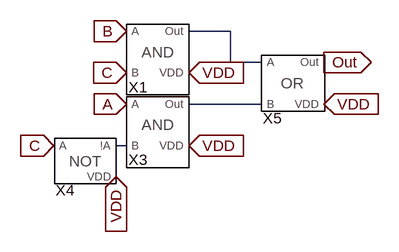
[diagram p0: schematic MUX.asc]
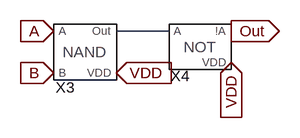
[diagram p1: sub-circuit gate_and.asc]
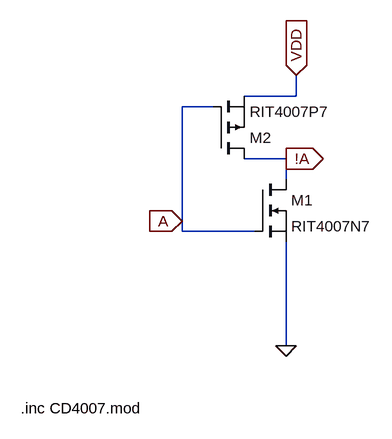
[diagram p2: sub-circuit gate_not.asc]
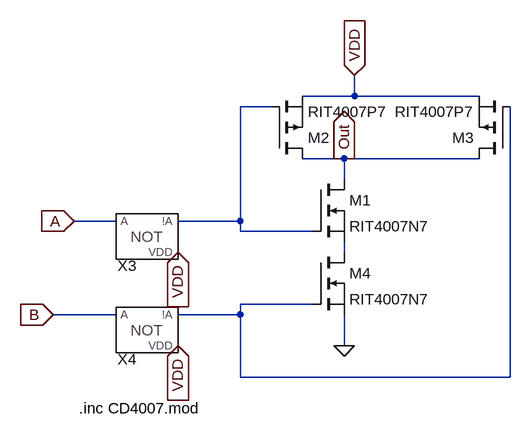
[diagram p3: sub-circuit gate_or.asc]
MUX.asc, the LTspice schematic file:
Version 4
SHEET 1 880 680
WIRE 288 112 224 112
WIRE 288 160 288 112
WIRE 336 160 288 160
WIRE 336 224 224 224
WIRE 128 288 112 288
FLAG 128 112 B
IOPIN 128 112 In
FLAG 128 176 C
IOPIN 128 176 In
FLAG 224 176 VDD
IOPIN 224 176 In
FLAG 128 224 A
IOPIN 128 224 In
FLAG 16 288 C
IOPIN 16 288 In
FLAG 224 288 VDD
IOPIN 224 288 In
FLAG 112 336 VDD
IOPIN 112 336 In
FLAG 432 160 Out
IOPIN 432 160 Out
FLAG 432 224 VDD
IOPIN 432 224 In
SYMBOL Gate_AND 176 144 R0
SYMATTR InstName X1
SYMBOL Gate_AND 176 256 R0
SYMATTR InstName X3
SYMBOL Gate_NOT 64 320 R0
SYMATTR InstName X4
SYMBOL Gate_OR 384 192 R0
SYMATTR InstName X5

gate_and.asc, the sub-circuit schematic file:
Version 4
SHEET 1 880 680
WIRE -144 0 -224 0
FLAG -224 64 VDD
IOPIN -224 64 In
FLAG -48 48 VDD
IOPIN -48 48 In
FLAG -320 64 B
IOPIN -320 64 In
FLAG -320 0 A
IOPIN -320 0 In
FLAG -48 0 Out
IOPIN -48 0 Out
SYMBOL Gate_NAND -272 32 R0
SYMATTR InstName X3
SYMBOL Gate_NOT -96 32 R0
SYMATTR InstName X4

gate_not.asc, the sub-circuit schematic file:
Version 4
SHEET 1 880 680
WIRE 64 -112 64 -144
WIRE 64 -112 -16 -112
WIRE -64 -96 -112 -96
WIRE 48 -16 -16 -16
WIRE 48 16 48 -16
WIRE -112 80 -112 -96
WIRE -112 96 -112 80
WIRE 0 96 -112 96
WIRE 48 272 48 112
FLAG 48 272 0
FLAG -112 80 A
IOPIN -112 80 In
FLAG 48 -16 !A
IOPIN 48 -16 Out
FLAG 64 -144 VDD
IOPIN 64 -144 In
SYMBOL nmos 0 16 R0
SYMATTR InstName M1
SYMATTR Value RIT4007N7
SYMBOL pmos -64 -16 M180
SYMATTR InstName M2
SYMATTR Value RIT4007P7
TEXT -360 368 Left 2 !.inc CD4007.mod

gate_or.asc, the sub-circuit schematic file:
Version 4
SHEET 1 880 680
WIRE 64 -112 64 -144
WIRE 64 -112 -16 -112
WIRE 256 -112 64 -112
WIRE -64 -96 -112 -96
WIRE 48 -16 -16 -16
WIRE 256 -16 48 -16
WIRE 48 16 48 -16
WIRE -304 80 -368 80
WIRE -112 80 -112 -96
WIRE -112 80 -208 80
WIRE -112 96 -112 80
WIRE 0 96 -112 96
WIRE 48 128 48 112
WIRE 0 208 -112 208
WIRE -304 224 -400 224
WIRE -112 224 -112 208
WIRE -112 224 -208 224
WIRE 48 272 48 224
WIRE -112 320 -112 224
WIRE 304 320 304 -96
WIRE 304 320 -112 320
FLAG 48 272 0
FLAG -368 80 A
IOPIN -368 80 In
FLAG -400 224 B
IOPIN -400 224 In
FLAG 48 -16 Out
IOPIN 48 -16 Out
FLAG 64 -144 VDD
IOPIN 64 -144 In
FLAG -208 128 VDD
IOPIN -208 128 In
FLAG -208 272 VDD
IOPIN -208 272 In
SYMBOL nmos 0 16 R0
SYMATTR InstName M1
SYMATTR Value RIT4007N7
SYMBOL pmos -64 -16 M180
SYMATTR InstName M2
SYMATTR Value RIT4007P7
SYMBOL pmos 304 -16 R180
SYMATTR InstName M3
SYMATTR Value RIT4007P7
SYMBOL nmos 0 128 R0
SYMATTR InstName M4
SYMATTR Value RIT4007N7
SYMBOL Gate_NOT -256 112 R0
SYMATTR InstName X3
SYMBOL Gate_NOT -256 256 R0
SYMATTR InstName X4
TEXT -360 368 Left 2 !.inc CD4007.mod

The netlist it stands for:
* MUX.asc
XX1 B C N001 VDD gate_and
XX3 A N003 N002 VDD gate_and
XX4 C VDD N003 gate_not
XX5 N001 N002 Out VDD gate_or

* block symbol definitions
.subckt gate_and A B Out VDD
XX3 A B N001 VDD Gate_NAND  ; pins A B Out VDD
XX4 N001 VDD Out gate_not
.ends gate_and

.subckt gate_not A VDD !A
M1 !A A 0 0 RIT4007N7
M2 !A A VDD VDD RIT4007P7
.inc CD4007.mod
.ends gate_not

.subckt gate_or A B Out VDD
M1 Out N001 N002 N002 RIT4007N7
M2 Out N001 VDD VDD RIT4007P7
M3 Out N003 VDD VDD RIT4007P7
M4 N002 N003 0 0 RIT4007N7
XX3 A VDD N001 gate_not
XX4 B VDD N003 gate_not
.inc CD4007.mod
.ends gate_or

.model NMOS NMOS
.model PMOS PMOS
.lib standard.mos
.backanno
.end